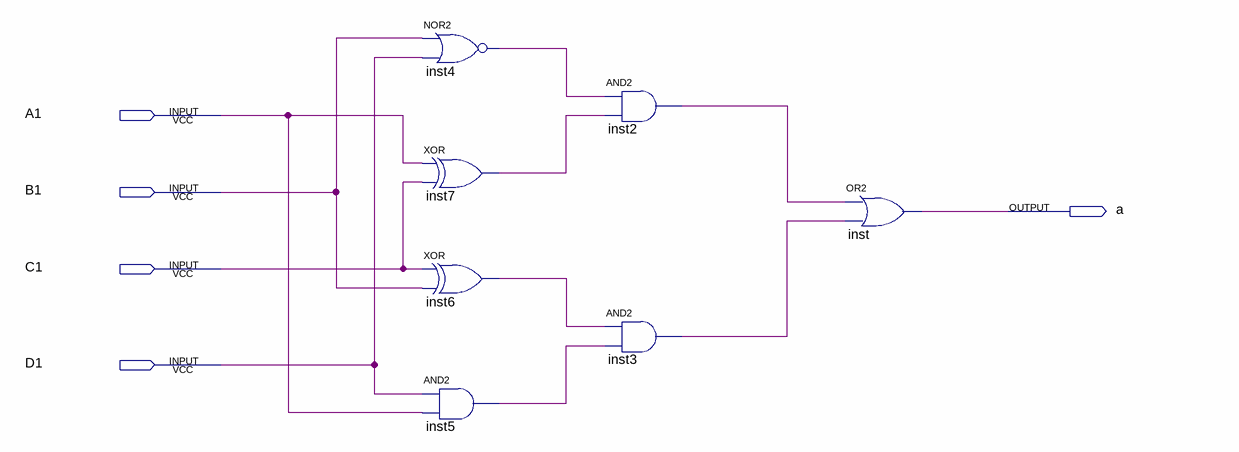
[diagram p0: schematic sheet]
// Quartus schematic Segment_a.bdf as structural Verilog: 7 symbols, 5 pins
module Segment_a (
  input  A1,
  input  B1,
  input  C1,
  input  D1,
  output a
);

  wire inst2_out, inst3_out, inst4_out, inst5_out, inst6_out, inst7_out;

  nor inst4 (inst4_out, B1, D1);
  xor inst7 (inst7_out, A1, C1);
  xor inst6 (inst6_out, C1, B1);
  and inst5 (inst5_out, D1, A1);
  and inst2 (inst2_out, inst4_out, inst7_out);
  and inst3 (inst3_out, inst6_out, inst5_out);
  or inst (a, inst2_out, inst3_out);
endmodule
